# EAGLE design circuit (EAGLE 6.4)
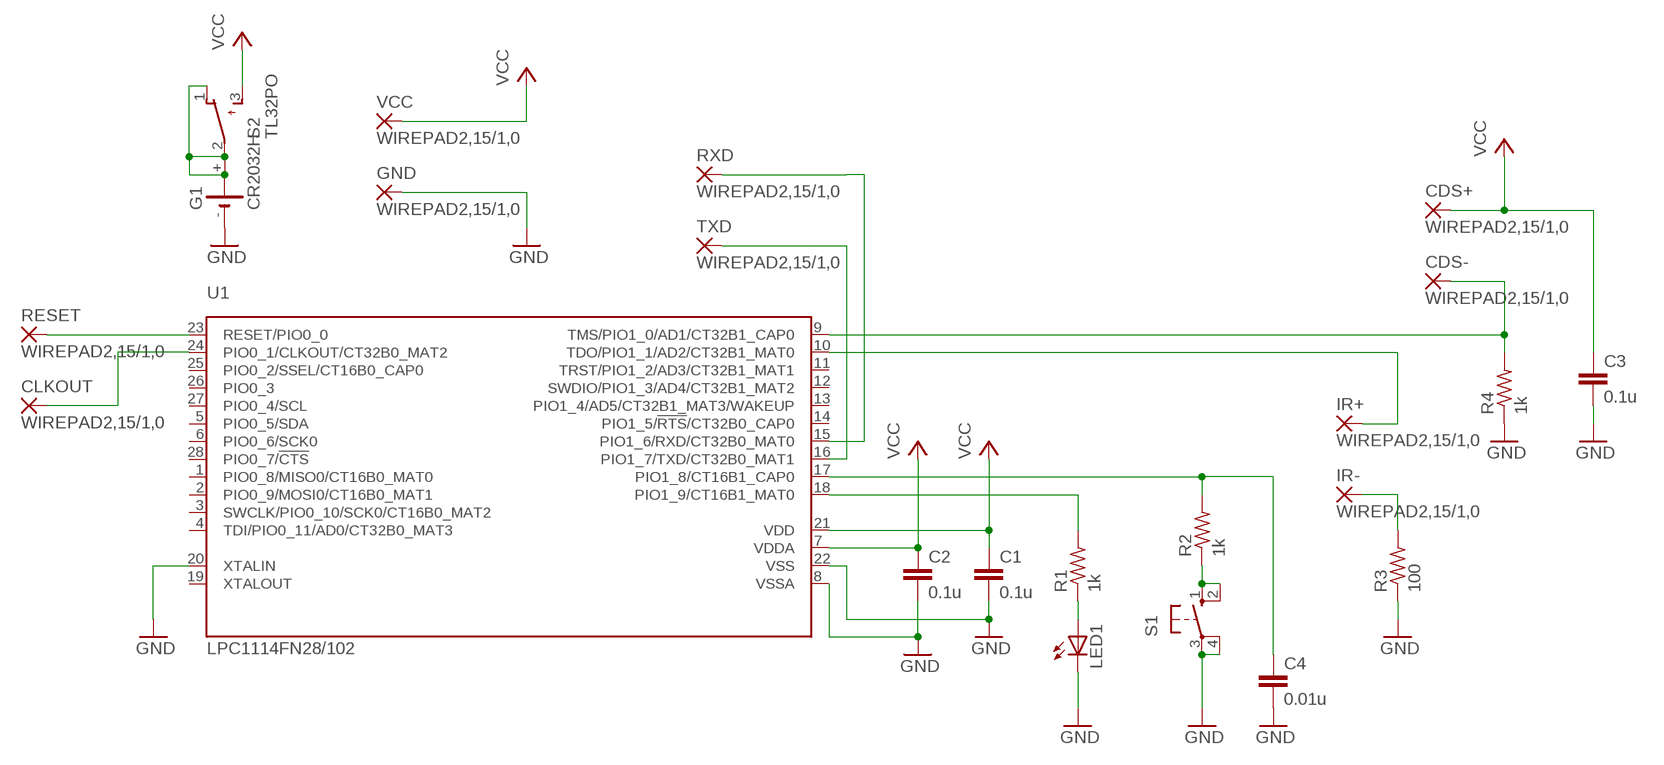
[diagram p0: schematic, sheet 1]

## Parts
C1  0.1u  C-EU025-024X044  [C025-024X044]
C2  0.1u  C-EU025-024X044  [C025-024X044]
C3  0.1u  C-EU025-024X044  [C025-024X044]
C4  0.01u  C-EU025-024X044  [C025-024X044]
CDS+  WIREPAD2,15/1,0  [2,15/1,0]
CDS-  WIREPAD2,15/1,0  [2,15/1,0]
CLKOUT  WIREPAD2,15/1,0  [2,15/1,0]
G1  CR2032H  [CR2032H]
GND  WIREPAD2,15/1,0  [2,15/1,0]
IR+  WIREPAD2,15/1,0  [2,15/1,0]
IR-  WIREPAD2,15/1,0  [2,15/1,0]
LED1  LED5MM  [LED5MM]
R1  1k  R-US_0204/7  [0204/7]
R2  1k  R-US_0204/7  [0204/7]
R3  100  R-US_0204/7  [0204/7]
R4  1k  R-US_0204/7  [0204/7]
RESET  WIREPAD2,15/1,0  [2,15/1,0]
RXD  WIREPAD2,15/1,0  [2,15/1,0]
S1  10-XX  [B3F-10XX]
S2  TL32PO  [TL3XPO]
TXD  WIREPAD2,15/1,0  [2,15/1,0]
U1  LPC1114FN28/102  [SOT117]
VCC  WIREPAD2,15/1,0  [2,15/1,0]

## Nets
GND: C1.2 C2.2 C3.2 C4.2 G1.- GND.1(P) LED1.K(C) R3.1 R4.1 S1.3(P) S1.4(P1) U1.8(VSSA) U1.20(XTALIN) U1.22(VSS)
GND2: TXD.1(P) U1.16(PIO1_7/TXD/CT32B0_MAT1)
N$1: IR-.1(P) R3.2
N$2: R2.1 S1.1(S) S1.2(S1)
N$3: RESET.1(P) U1.23(RESET/PIO0_0)
N$4: CLKOUT.1(P) U1.24(PIO0_1/CLKOUT/CT32B0_MAT2)
N$5: G1.+ G1.+@1(+) S2.1(O) S2.2(P)
N$6: R1.2 U1.18(PIO1_9/CT16B1_MAT0)
N$7: C4.1 R2.2 U1.17(PIO1_8/CT16B1_CAP0)
N$8: LED1.A R1.1
N$9: CDS-.1(P) R4.2 U1.9(TMS/PIO1_0/AD1/CT32B1_CAP0)
VCC: C1.1 C2.1 C3.1 CDS+.1(P) S2.3(S) U1.7(VDDA) U1.21(VDD) VCC.1(P)
VCC1: IR+.1(P) U1.10(TDO/PIO1_1/AD2/CT32B1_MAT0)
VCC3: RXD.1(P) U1.15(PIO1_6/RXD/CT32B0_MAT0)
Unconnected: U1.1(PIO0_8/MISO0/CT16B0_MAT0) U1.2(PIO0_9/MOSI0/CT16B0_MAT1) U1.3(SWCLK/PIO0_10/SCK0/CT16B0_MAT2) U1.4(TDI/PIO0_11/AD0/CT32B0_MAT3) U1.5(PIO0_5/SDA) U1.6(PIO0_6/SCK0) U1.11(TRST/PIO1_2/AD3/CT32B1_MAT1) U1.12(SWDIO/PIO1_3/AD4/CT32B1_MAT2) U1.13(PIO1_4/AD5/CT32B1_MAT3/WAKEUP) U1.14(PIO1_5/!RTS!/CT32B0_CAP0) U1.19(XTALOUT) U1.25(PIO0_2/SSEL/CT16B0_CAP0) U1.26(PIO0_3) U1.27(PIO0_4/SCL) U1.28(PIO0_7/!CTS!)

## Library data of the parts
C1-C4 = rcl:C-EU: CAPACITOR, European symbol
CDS+ CDS- CLKOUT GND IR+ IR- RESET RXD TXD VCC = wirepad:WIREPAD: Wire PAD connect wire on PCB
G1 = battery:CR2032H: LI BATTERY Varta
LED1 = led:LED: LED OSRAM: - CHIPLED LG R971, LG N971, LY N971, LG Q971, LY Q971, LO R971, LY R971 LH N974, LH R974 LS Q976, LO Q976, LY Q976 LO Q996 - Hyper CHIPLED LW Q18S LB Q993, LB Q99A, LB R99A - SideLED LS A670, LO A670, LY A670, LG A670, LP A670 LB A673, LV A673, LT A673, LW A673 LH A674 LY A675 LS A676, LA A676, LO A676, LY A676, LW A676 LS A679, LY A679, LG A679 - Hyper Micro SIDELED® LS Y876, LA Y876, LO Y876, LY Y876 LT Y87S - SmartLED LW L88C, LW L88S LB L89C, LB L89S, LG L890 LS L89K, LO L89K, LY L89K LS L896, LA L896, LO L896, LY L896 - TOPLED LS T670, LO T670, LY T670, LG T670, LP T670 LSG T670, LSP T670, LSY T670, LOP T670, LYG T670 LG T671, LOG T671, LSG T671 LB T673, LV T673, LT T673, LW T673 LH T674 LS T676, LA T676, LO T676, LY T676, LB T676, LH T676, LSB T676, LW T676 LB T67C, LV T67C, LT T67C, LS T67K, LO T67K, LY T67K, LW E67C LS E67B, LA E67B, LO E67B, LY E67B, LB E67C, LV E67C, LT E67C LW T67C LS T679, LY T679, LG T679 LS T770, LO T770, LY T770, LG T770, LP T770 LB T773, LV T773, LT T773, LW T773 LH T774 LS E675, LA E675, LY E675, LS T675 LS T776, LA T776, LO T776, LY T776, LB T776 LHGB T686 LT T68C, LB T68C - Hyper Mini TOPLED® LB M676 - Mini TOPLED Santana® LG M470 LS M47K, LO M47K, LY M47K Source: http://www.osram.convergy.de LUXEON: - LUMILED® LXK2-PW12-R00, LXK2-PW12-S00, LXK2-PW14-U00, LXK2-PW14-V00 LXK2-PM12-R00, LXK2-PM12-S00, LXK2-PM14-U00 LXK2-PE12-Q00, LXK2-PE12-R00, LXK2-PE12-S00, LXK2-PE14-T00, LXK2-PE14-U00 LXK2-PB12-K00, LXK2-PB12-L00, LXK2-PB12-M00, LXK2-PB14-N00, LXK2-PB14-P00, LXK2-PB14-Q00 LXK2-PR12-L00, LXK2-PR12-M00, LXK2-PR14-Q00, LXK2-PR14-R00 LXK2-PD12-Q00, LXK2-PD12-R00, LXK2-PD12-S00 LXK2-PH12-R00, LXK2-PH12-S00 LXK2-PL12-P00, LXK2-PL12-Q00, LXK2-PL12-R00 Source: www.luxeon.com KINGBRIGHT: KA-3528ASYC Source: www.kingbright.com
R1-R4 = rcl:R-US_: RESISTOR, American symbol
S1 = switch-omron:10-XX: OMRON SWITCH; MPN: B3F-1000; OC_FARNELL: 176432; OC_NEWARK: 36M3542
S2 = switch:TL32PO: TINY SWITCH ON - MOM Source: http://www2.produktinfo.conrad.com/datenblaetter/700000-724999/705152-da-01-de-Subminiaturschalter_TL_36YO.pdf
U1 = nxp_60_1_1:LPC1114FN28: 32-bit ARM Cortex-M0 microcontroller; up to 64 kB flash and 8 kB SRAM The LPC1110/11/12/13/14/15 are a ARM Cortex-M0 based, low-cost 32-bit MCU family, designed for 8/16-bit microcontroller applications, offering performance, low power, simple instruction set and memory addressing together with reduced code size compared to existing 8/16-bit architectures. The LPC1110/11/12/13/14/15 operate at CPU frequencies of up to 50 MHz. The peripheral complement of the LPC1110/11/12/13/14/15 includes up to 64 kB of flash memory, up to 8 kB of data memory, one Fast-mode Plus I 2 C-bus interface, one RS-485/EIA-485 UART, up to two SPI interfaces with SSP features, four general purpose counter/timers, a 10-bit ADC, and up to 42 general purpose I/O pins. Remark: The LPC111x series consists of the LPC1100 series (parts LPC111x/101/201/301), LPC1100L series (parts LPC111x/002/102/202/302), and the LPC1100XL series (parts LPC111x/103/203/303/323/333). The LPC1100L and LPC1100XL series include the power profiles, a windowed watchdog timer, and a configurable open-drain mode. AAL Eindhoven MK; ADC: 6; FLASH: 32kB; GPIO: 22; PWR_PROFILES: yes; SERIES: LPC1100L; SPI: 1; SRAM: 4kB

## Board
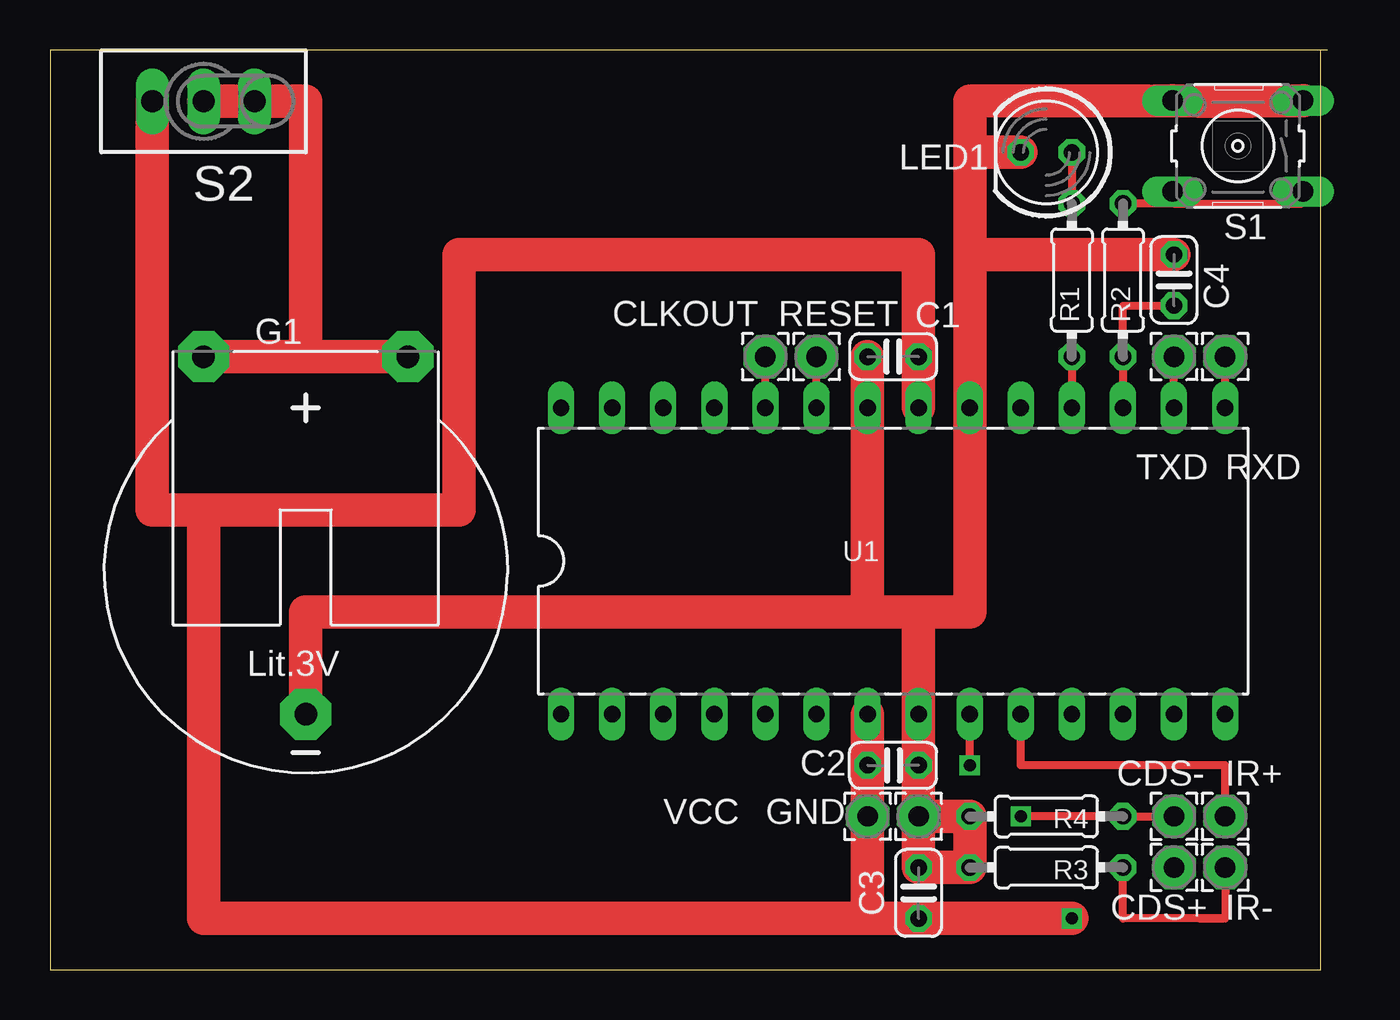
[diagram p1: board, top side]
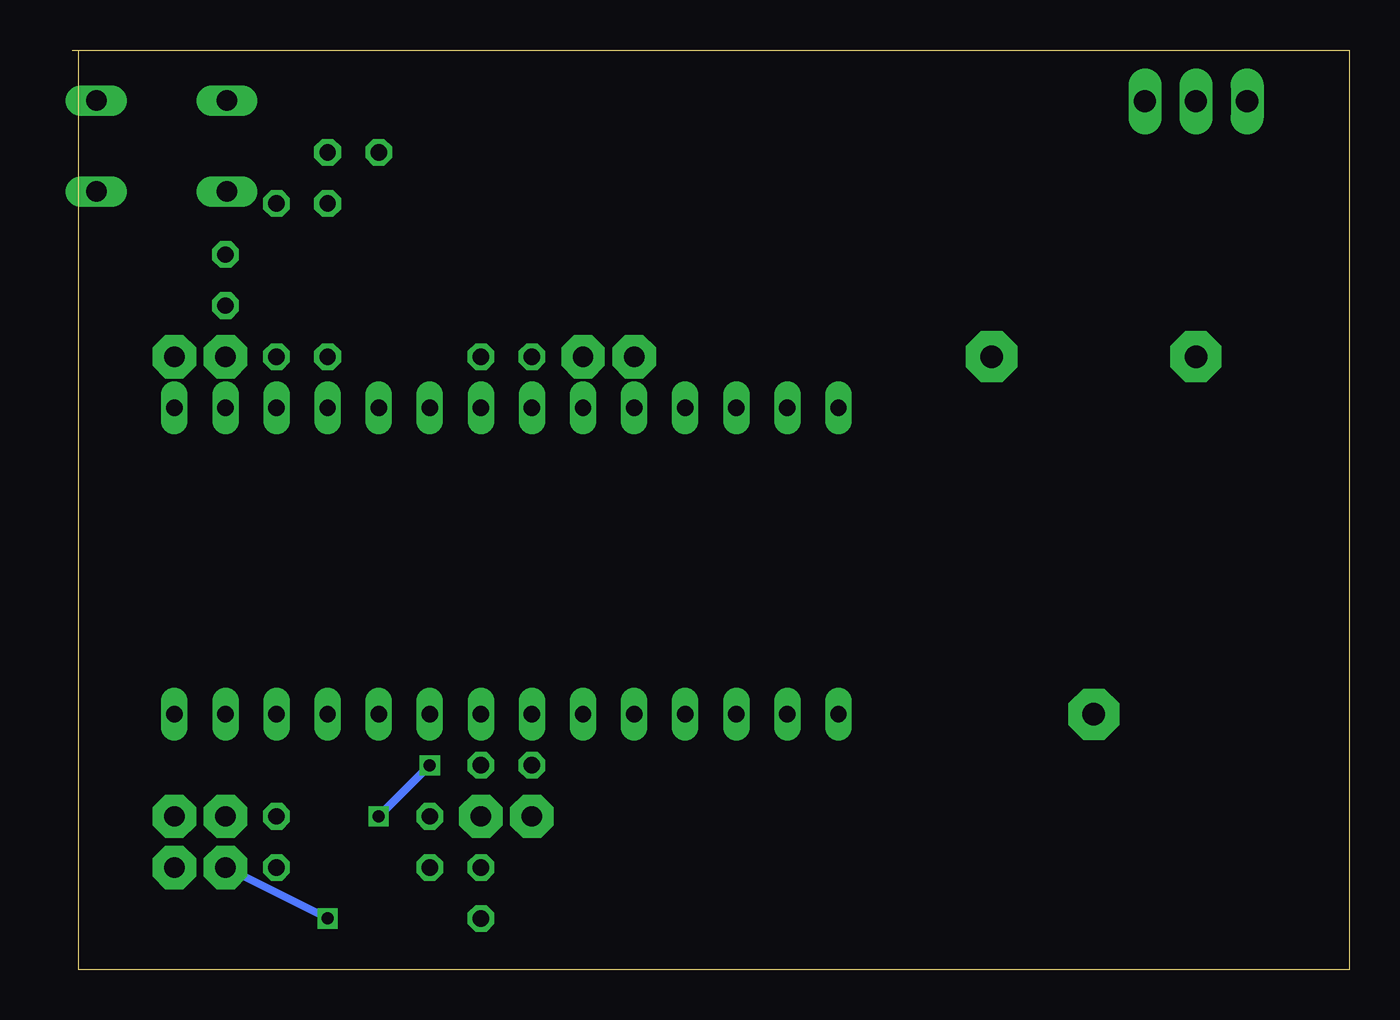
[diagram p2: board, bottom side, seen from below]

Size 63.5 x 45.72 mm. Coordinates in mm from the lower left corner, seen from the top.
Outline: 63.17,45.71 63.17,0 0,0 0,45.72 63.5,45.71
Copper layers (1*16): Top 0.035mm / dielectric 1.5mm / Bottom 0.035mm
Design rules "default": minimum track width 10mil, minimum drill 24mil, track to track 8mil, track to pad 8mil, pad to pad 8mil, via to via 8mil, smd to smd 8mil, copper to edge 40mil, drill to drill 8mil, minimum pad ring 10mil, minimum via ring 8mil, stop-mask expansion 4mil, vias tented up to drill 0mil, thermal gap 10mil

### Footprints (pad centres in the part's own frame; a part is rotated, then mirrored left to right if it is on the bottom)
C025-024X044 = drill 0.813 octagon: 1 -1.27,0; 2 1.27,0
2,15/1,0 = drill 1.016 pad 2.159 octagon: 1 0,0
CR2032H = drill 1.118 pad 2.54 octagon: + 5.08,10.795; +@1 -5.08,10.795; - 0,-6.985
LED5MM = drill 0.813 octagon: A -1.27,0; K 1.27,0
0204/7 = drill 0.813 octagon: 1 -3.81,0; 2 3.81,0
B3F-10XX = drill 1.016 long: 1 -3.251,2.261; 2 3.251,2.261; 3 -3.251,-2.261; 4 3.251,-2.261
TL3XPO = drill 1.1 pad 1.422 long: 1 -2.54,0; 2 0,0; 3 2.54,0
SOT117 = drill 0.813 long: 1 -16.51,-7.62; 2 -13.97,-7.62; 3 -11.43,-7.62; 4 -8.89,-7.62; 5 -6.35,-7.62; 6 -3.81,-7.62; 7 -1.27,-7.62; 8 1.27,-7.62; 9 3.81,-7.62; 10 6.35,-7.62; 11 8.89,-7.62; 12 11.43,-7.62; 13 13.97,-7.62; 14 16.51,-7.62; 15 16.51,7.62; 16 13.97,7.62; 17 11.43,7.62; 18 8.89,7.62; 19 6.35,7.62; 20 3.81,7.62; 21 1.27,7.62; 22 -1.27,7.62; 23 -3.81,7.62; 24 -6.35,7.62; 25 -8.89,7.62; 26 -11.43,7.62; 27 -13.97,7.62; 28 -16.51,7.62

### Placement (x,y rotation side)
C1  41.91,30.48 180 top
C2  41.91,10.16 0 top
C3  43.18,3.81 90 top
C4  55.88,34.29 90 top
CDS+  55.88,5.08 0 top
CDS-  55.88,7.62 0 top
CLKOUT  35.56,30.48 0 top
G1  12.7,19.68 0 top
GND  43.18,7.62 0 top
IR+  58.42,7.62 0 top
IR-  58.42,5.08 0 top
LED1  49.53,40.64 180 top
R1  50.8,34.29 270 top
R2  53.34,34.29 270 top
R3  49.53,5.08 0 top
R4  49.53,7.62 0 top
RESET  38.1,30.48 0 top
RXD  58.42,30.48 0 top
S1  59.05,40.96 180 top
S2  7.62,43.18 180 top
TXD  55.88,30.48 0 top
U1  41.91,20.32 0 top
VCC  40.64,7.62 0 top

### Tracks (layer width: path | path; a pad name or v marks a point on that pad's centre or on a via)
GND
  Top 0.254: C1.2 U1.22 | 43.18,17.78 45.72,17.78 | 45.72,17.78 U1.20 45.72,17.78 | 45.72,17.78 45.72,35.56
  Top 0.406: GND.1 C3.2 | 40.64,17.78 43.18,17.78
  Top 1.676: 45.72,40.64 LED1.K 45.72,40.64 | 45.72,40.64 45.72,43.18 S1.4 57.15,43.18 59.69,43.18 S1.3 | 43.18,17.78 43.18,15.24 U1.8 C2.2 GND.1 | 45.72,35.56 C4.2 | 43.18,17.78 45.72,17.78 45.72,40.64 | 43.18,17.78 40.64,17.78 | 40.64,17.78 C1.2 | GND.1 R4.1 R3.1 C3.2 GND.1 | G1.- 12.7,17.78 40.64,17.78
GND2
  Top 0.406: U1.16 TXD.1
N$1
  Top 0.406: R3.2 53.34,2.54 57.15,2.54 | 58.42,2.54 57.15,2.54 | 57.15,2.54 58.42,2.54 | 58.42,2.54 57.15,2.54 | IR-.1 58.42,2.54
N$2
  Top 0.406: 55.88,38.1 R2.1 | 55.88,38.1 S1.2 55.88,38.1 | 55.88,38.1 62.23,38.1 S1.1
N$3
  Top 0.406: U1.23 RESET.1
N$4
  Top 0.406: U1.24 CLKOUT.1
N$5
  Top 1.676: 12.7,30.48 G1.+@1 12.7,30.48 | 12.7,30.48 G1.+ | 12.7,30.48 12.7,43.18 S2.1 S2.2
N$6
  Top 0.406: R1.2 U1.18
N$7
  Top 0.406: U1.17 R2.2 53.34,33.02 C4.1
N$8
  Top 0.406: LED1.A R1.1
N$9  (via drill 0.6)
  Top 0.406: CDS-.1 R4.2 v48.26,7.62 | v45.72,10.16 45.72,10.79 U1.9
  Bottom 0.406: v48.26,7.62 v45.72,10.16
VCC  (via drill 0.6)
  Top 0.254: C1.1 U1.21
  Top 1.676: U1.7 C2.1 VCC.1 40.64,2.54 | v50.8,2.54 C3.1 40.64,2.54 | S2.3 5.08,22.86 7.62,22.86 | 7.62,22.86 7.62,2.54 | 7.62,2.54 40.64,2.54 | U1.21 43.18,35.56 20.32,35.56 20.32,22.86 7.62,22.86 | 7.62,22.86 7.62,2.54
  Bottom 0.406: v50.8,2.54 CDS+.1
VCC1
  Top 0.406: U1.10 48.26,10.16 55.88,10.16 58.42,10.16 IR+.1
VCC3
  Top 0.406: U1.15 RXD.1